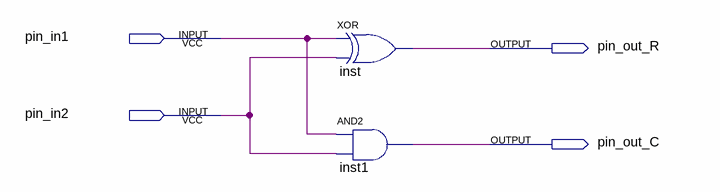
[diagram p0: schematic sheet]
// Quartus schematic 1BitHalfAdder.bdf as structural Verilog: 2 symbols, 4 pins
module \1BitHalfAdder  (
  input  pin_in1,
  input  pin_in2,
  output pin_out_R,
  output pin_out_C
);

  xor inst (pin_out_R, pin_in1, pin_in2);
  and inst1 (pin_out_C, pin_in1, pin_in2);
endmodule
